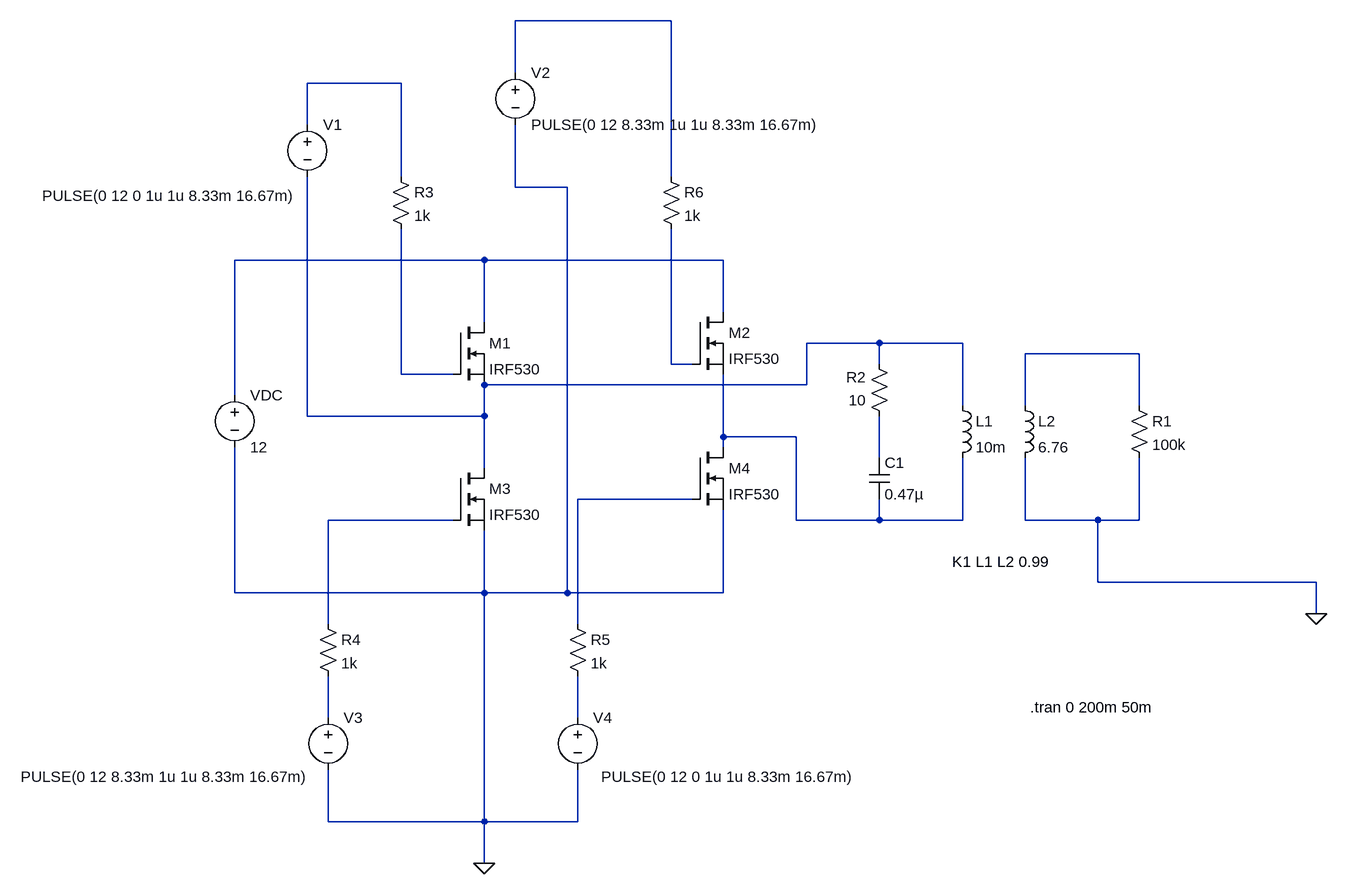
[diagram p0: schematic Square_wave_inverter_DCtoAC.asc]
Square_wave_inverter_DCtoAC.asc, the LTspice schematic file:
Version 4.1
SHEET 1 2052 868
WIRE 896 -448 656 -448
WIRE 656 -368 656 -448
WIRE 480 -352 336 -352
WIRE 336 -288 336 -352
WIRE 480 -208 480 -352
WIRE 896 -208 896 -448
WIRE 656 -192 656 -288
WIRE 736 -192 656 -192
WIRE 608 -80 224 -80
WIRE 976 -80 608 -80
WIRE 976 0 976 -80
WIRE 608 16 608 -80
WIRE 1216 48 1104 48
WIRE 1344 48 1216 48
WIRE 1616 64 1440 64
WIRE 896 80 896 -128
WIRE 928 80 896 80
WIRE 1216 80 1216 48
WIRE 480 96 480 -128
WIRE 560 96 480 96
WIRE 1104 112 1104 48
WIRE 1104 112 608 112
WIRE 224 128 224 -80
WIRE 1344 144 1344 48
WIRE 1440 144 1440 64
WIRE 1616 144 1616 64
WIRE 336 160 336 -208
WIRE 608 160 608 112
WIRE 608 160 336 160
WIRE 976 192 976 96
WIRE 1088 192 976 192
WIRE 976 208 976 192
WIRE 1216 224 1216 160
WIRE 608 240 608 160
WIRE 928 288 752 288
WIRE 560 320 368 320
WIRE 1088 320 1088 192
WIRE 1216 320 1216 288
WIRE 1216 320 1088 320
WIRE 1344 320 1344 224
WIRE 1344 320 1216 320
WIRE 1440 320 1440 224
WIRE 1552 320 1440 320
WIRE 1616 320 1616 224
WIRE 1616 320 1552 320
WIRE 1552 416 1552 320
WIRE 1888 416 1552 416
WIRE 224 432 224 208
WIRE 608 432 608 336
WIRE 608 432 224 432
WIRE 736 432 736 -192
WIRE 736 432 608 432
WIRE 976 432 976 304
WIRE 976 432 736 432
WIRE 1888 464 1888 416
WIRE 368 480 368 320
WIRE 752 480 752 288
WIRE 368 624 368 560
WIRE 752 624 752 560
WIRE 368 784 368 704
WIRE 608 784 608 432
WIRE 608 784 368 784
WIRE 752 784 752 704
WIRE 752 784 608 784
WIRE 608 848 608 784
FLAG 1888 464 0
FLAG 608 848 0
SYMBOL voltage 224 112 R0
WINDOW 123 0 0 Left 0
WINDOW 39 0 0 Left 0
SYMATTR InstName VDC
SYMATTR Value 12
SYMBOL nmos 560 16 R0
SYMATTR InstName M1
SYMATTR Value IRF530
SYMBOL nmos 928 0 R0
SYMATTR InstName M2
SYMATTR Value IRF530
SYMBOL ind 1328 128 R0
SYMATTR InstName L1
SYMATTR Value 10m
SYMATTR Type ind
SYMATTR SpiceLine Rser=1m
SYMBOL ind 1424 128 R0
SYMATTR InstName L2
SYMATTR Value 6.76
SYMATTR Type ind
SYMATTR SpiceLine Rser=1m
SYMBOL res 1600 128 R0
SYMATTR InstName R1
SYMATTR Value 100k
SYMBOL voltage 336 -304 R0
WINDOW 3 -408 125 Left 2
WINDOW 123 0 0 Left 0
WINDOW 39 0 0 Left 0
SYMATTR InstName V1
SYMATTR Value PULSE(0 12 0 1u 1u 8.33m 16.67m)
SYMBOL voltage 656 -384 R0
WINDOW 123 0 0 Left 0
WINDOW 39 0 0 Left 0
SYMATTR InstName V2
SYMATTR Value PULSE(0 12 8.33m 1u 1u 8.33m 16.67m)
SYMBOL voltage 752 608 R0
WINDOW 3 36 107 Left 2
WINDOW 123 0 0 Left 0
WINDOW 39 0 0 Left 0
SYMATTR InstName V4
SYMATTR Value PULSE(0 12 0 1u 1u 8.33m 16.67m)
SYMBOL voltage 368 608 R0
WINDOW 3 -473 107 Left 2
WINDOW 123 0 0 Left 0
WINDOW 39 0 0 Left 0
SYMATTR InstName V3
SYMATTR Value PULSE(0 12 8.33m 1u 1u 8.33m 16.67m)
SYMBOL nmos 560 240 R0
SYMATTR InstName M3
SYMATTR Value IRF530
SYMBOL nmos 928 208 R0
SYMATTR InstName M4
SYMATTR Value IRF530
SYMBOL res 1232 176 R180
WINDOW 0 36 76 Left 2
WINDOW 3 36 40 Left 2
SYMATTR InstName R2
SYMATTR Value 10
SYMBOL cap 1200 224 R0
SYMATTR InstName C1
SYMATTR Value 0.47µ
SYMBOL res 464 -224 R0
SYMATTR InstName R3
SYMATTR Value 1k
SYMBOL res 352 464 R0
SYMATTR InstName R4
SYMATTR Value 1k
SYMBOL res 736 464 R0
SYMATTR InstName R5
SYMATTR Value 1k
SYMBOL res 880 -224 R0
SYMATTR InstName R6
SYMATTR Value 1k
TEXT 1328 384 Left 2 !K1 L1 L2 0.99
TEXT 1448 608 Left 2 !.tran 0 200m 50m

The netlist it stands for:
* Square_wave_inverter_DCtoAC.asc
VDC N003 0 12
M1 N003 N007 N004 N004 IRF530
M2 N003 N006 N008 N008 IRF530
L1 N004 N008 10m Rser=1m
L2 N005 0 6.76 Rser=1m
R1 N005 0 100k
V1 N002 N004 PULSE(0 12 0 1u 1u 8.33m 16.67m)
V2 N001 0 PULSE(0 12 8.33m 1u 1u 8.33m 16.67m)
V4 N013 0 PULSE(0 12 0 1u 1u 8.33m 16.67m)
V3 N012 0 PULSE(0 12 8.33m 1u 1u 8.33m 16.67m)
M3 N004 N011 0 0 IRF530
M4 N008 N010 0 0 IRF530
R2 N009 N004 10
C1 N009 N008 0.47µ
R3 N002 N007 1k
R4 N011 N012 1k
R5 N010 N013 1k
R6 N001 N006 1k
.model NMOS NMOS
.model PMOS PMOS
.lib standard.mos
K1 L1 L2 0.99
.tran 0 200m 50m
.backanno
.end